# EasyEDA schematic EasyEDA-schematic-normal-version.json
TITLE: RFID password generator - normal version; REV: 1.0; Date: 2017-09-15; Sheet: 1/1; Drawn By: Julian Schuler
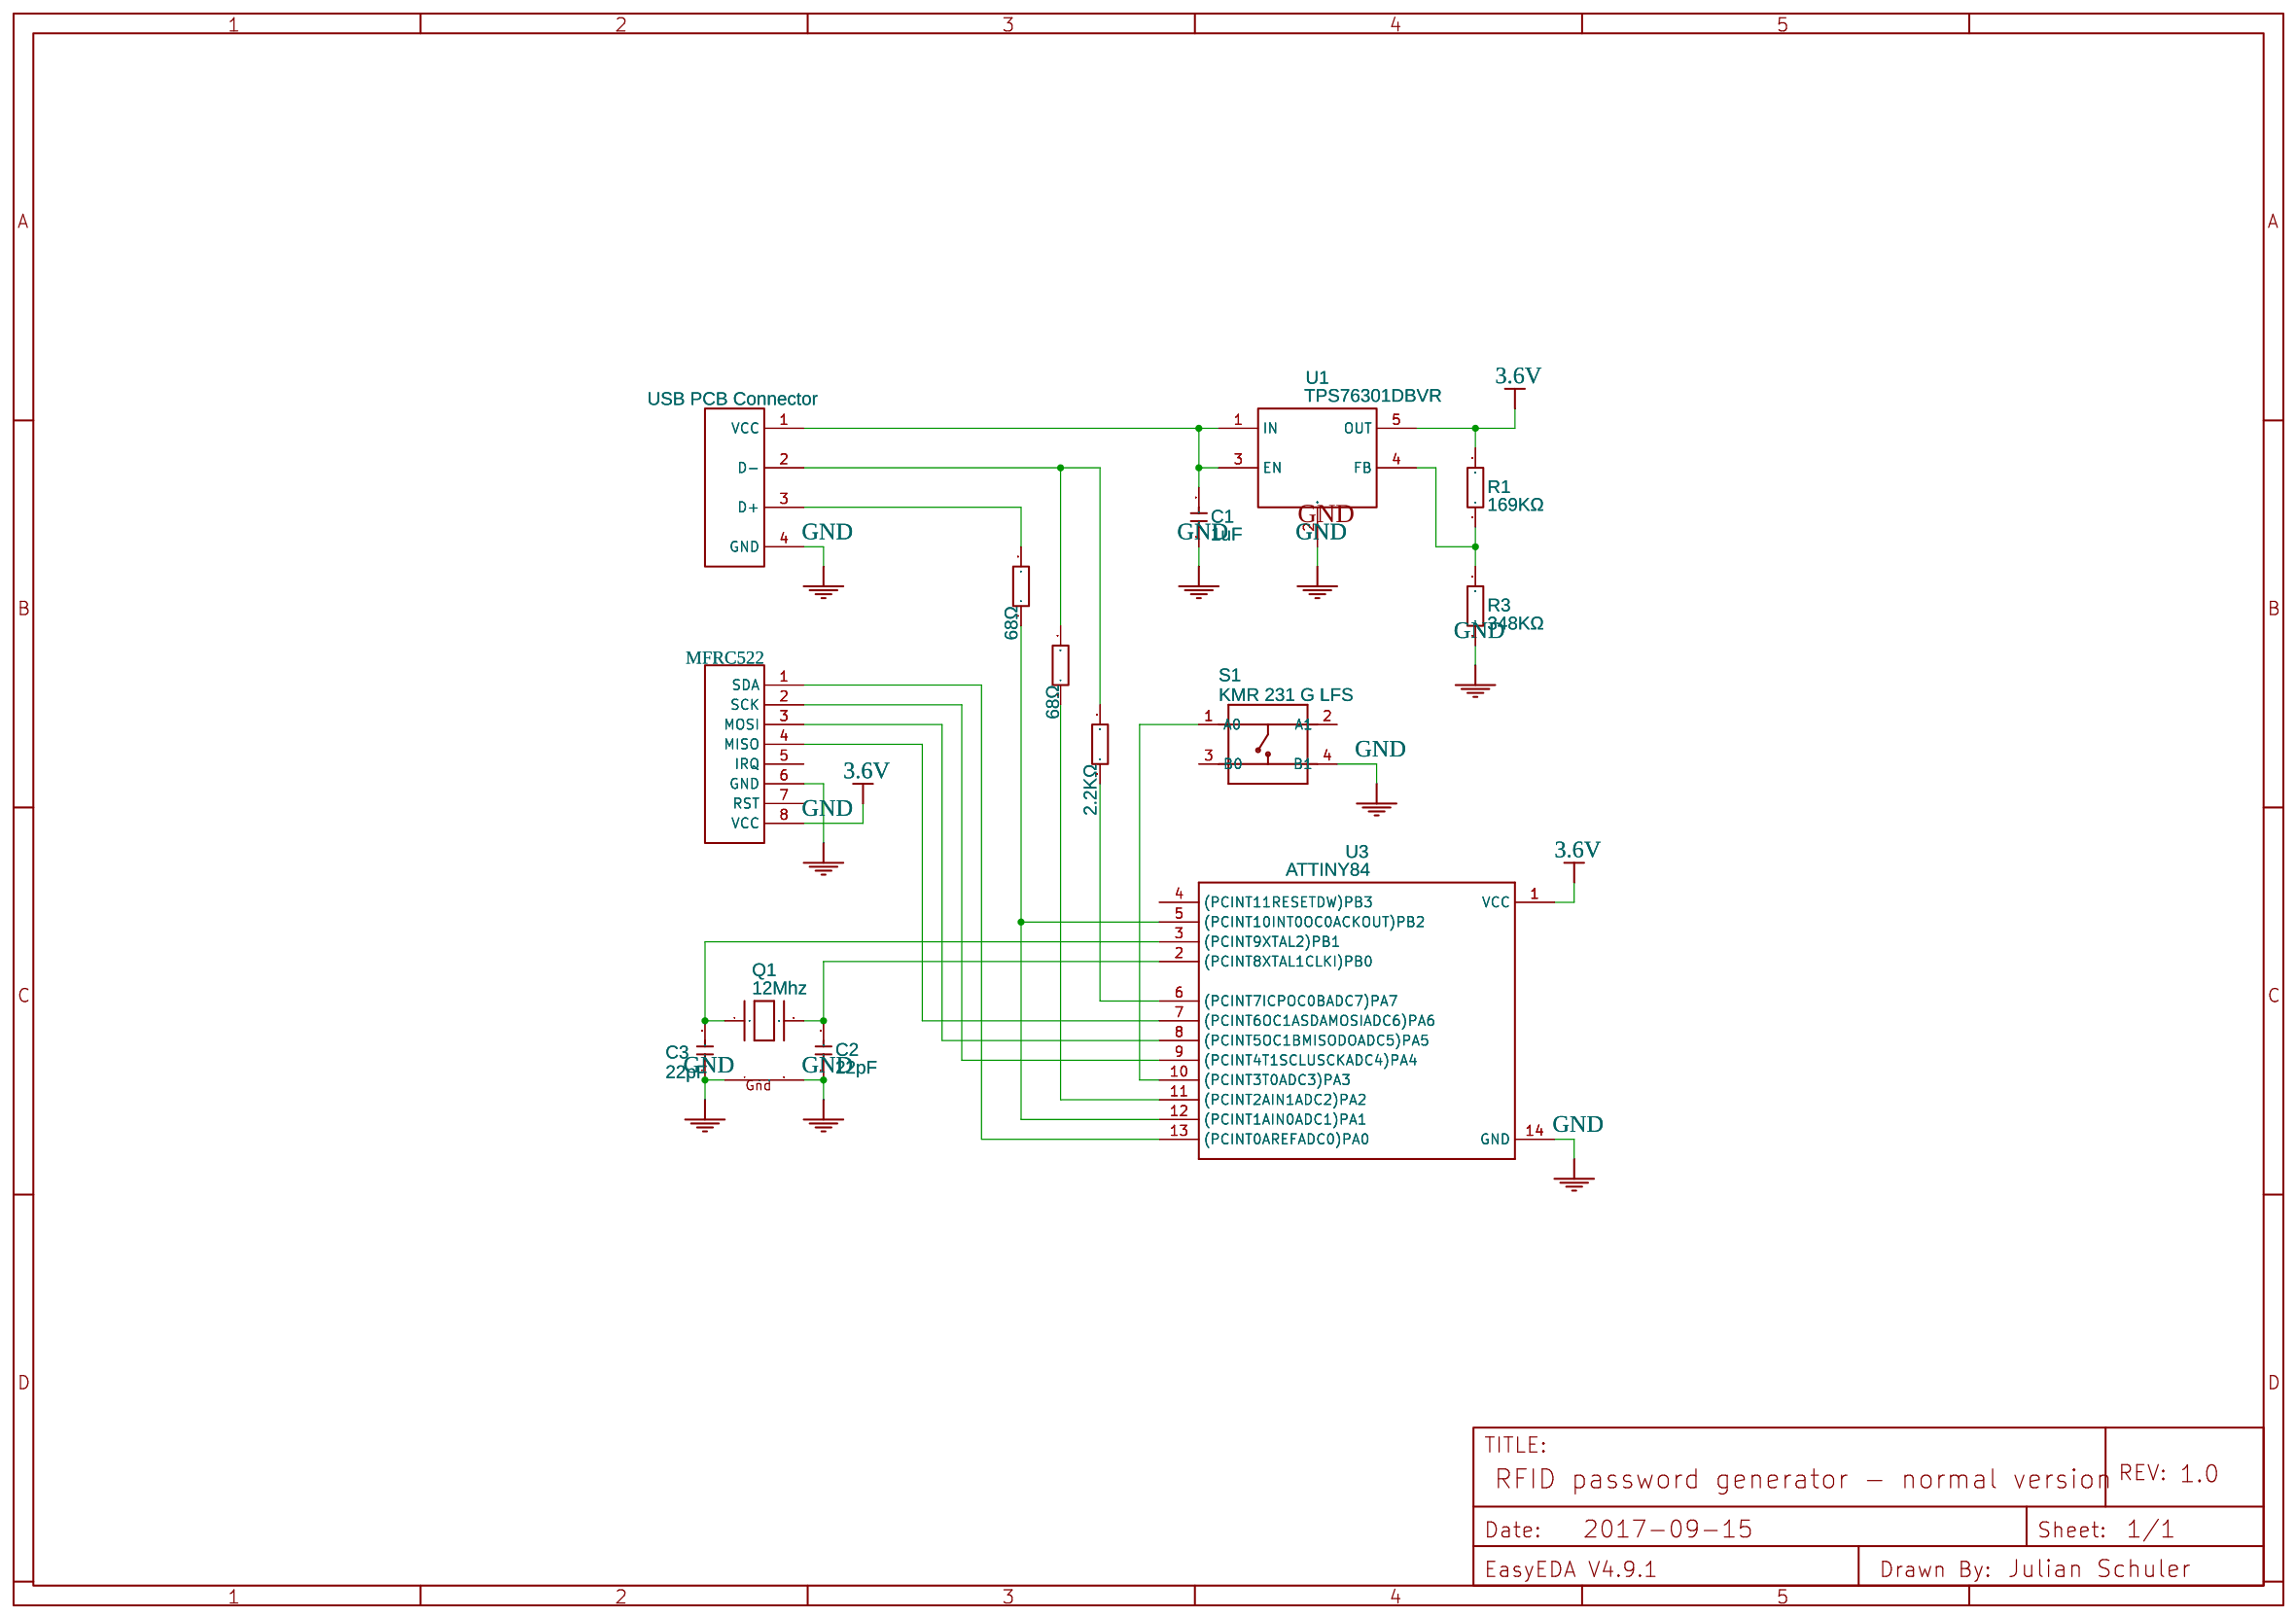
[diagram p0: schematic sheet]

## Parts
C1  1uF  [C0805]
C2  22pF  [C0805]
C3  22pF  [C0805]
Q1  12Mhz  [NX3225]
R1  169KΩ  [0805]
R2  68Ω  [0805]
R3  348KΩ  [0805]
R4  68Ω  [0805]
R5  2.2KΩ  [0805]
S1  KMR 231 G LFS  [SW4-SMD-4.2X3.2X2.5MM]
U  MFRC522  [1X8 PIN HEADER]
U1  TPS76301DBVR  [SOT-23-5]
U2  USB PCB Connector  [USB PCB CONNECTOR]
U3  ATTINY84  [SO14]

## Library data of the parts
C1 = -: SMD CAP Ceramic 1uF-25V-10%-X7R; catid: 20; Manufacturer Part: CC0805KKX7R8BB105
C2 C3 = -: SMD CAP Ceramic 22pF-50V-5%-NPO; catid: 20; Manufacturer Part: CC0805JRNPO9BN220
Q1 = -: Classic 4-pin 3.2 x 2.5mm crystal; catid: 20; Contributor: Adafruit; Manufacturer Part: ?
R1 = -: Power: 1/8W; Tolerance: ±1%; Supplier: LCSC; Manufacturer: UniOhm; Manufacturer Part: 0805W8F1693T5E; LCSC: C17488
R2 R4 = -: Power: 1/8W; Tolerance: ±5%; Supplier: LCSC; Manufacturer: UniOhm; Manufacturer Part: 0805W8J0680T5E; LCSC: C25325
R3 = -: Power: 1/8W; Tolerance: ±1%; Supplier: LCSC; Manufacturer: UniOhm; Manufacturer Part: 0805W8F3483T5E; LCSC: C17638
R5 = -: Power: 1/8W; Tolerance: ±1%; Supplier: LCSC; Manufacturer: UniOhm; Manufacturer Part: 0805W8F2201T5E; LCSC: C17520; LCSC Assembly: Yes
S1 = -: SMD Button Top; catid: 20; Manufacturer Part: DHT-4235A
U1 = -: catid: 20; Supplier: LCSC; Manufacturer: TI; LCSC: C7727
U2 = -: Contributor: Julian42
U3 = -: catid: 20; Contributor: SparkFun; Manufacturer Part: ?

## Nets
3.6V: R1.2 U.8(VCC) U1.5(OUT) U3.1(VCC)
GND: C1.1 C2.1 C3.1 Q1.2(G2) Q1.4(G1) R3.1 S1.4(B1) U.6(GND) U1.2(GND) U2.4(GND) U3.14(GND)
Net-(C1-2): C1.2 U1.1(IN) U1.3(EN) U2.1(VCC)
Net-(C2-2): C2.2 Q1.3(X2) U3.2((PCINT8XTAL1CLKI)PB0)
Net-(C3-2): C3.2 Q1.1(X1) U3.3((PCINT9XTAL2)PB1)
Net-(R1-1): R1.1 R3.2 U1.4(FB)
Net-(R2-1): R2.1 U3.11((PCINT2AIN1ADC2)PA2)
Net-(R2-2): R2.2 R5.2 U2.2(D-)
Net-(R4-1): R4.1 U3.5((PCINT10INT0OC0ACKOUT)PB2) U3.12((PCINT1AIN0ADC1)PA1)
Net-(R4-2): R4.2 U2.3(D+)
Net-(R5-1): R5.1 U3.6((PCINT7ICPOC0BADC7)PA7)
Net-(S1-1): S1.1(A0) U3.10((PCINT3T0ADC3)PA3)
Net-(U-1): U.1(SDA) U3.13((PCINT0AREFADC0)PA0)
Net-(U-2): U.2(SCK) U3.9((PCINT4T1SCLUSCKADC4)PA4)
Net-(U-3): U.3(MOSI) U3.8((PCINT5OC1BMISODOADC5)PA5)
Net-(U-4): U.4(MISO) U3.7((PCINT6OC1ASDAMOSIADC6)PA6)

Not connected (* = marked no-connect by the designer): S1 2(A1) 3(B0); U 5(IRQ) 7(RST); U3 4((PCINT11RESETDW)PB3)
